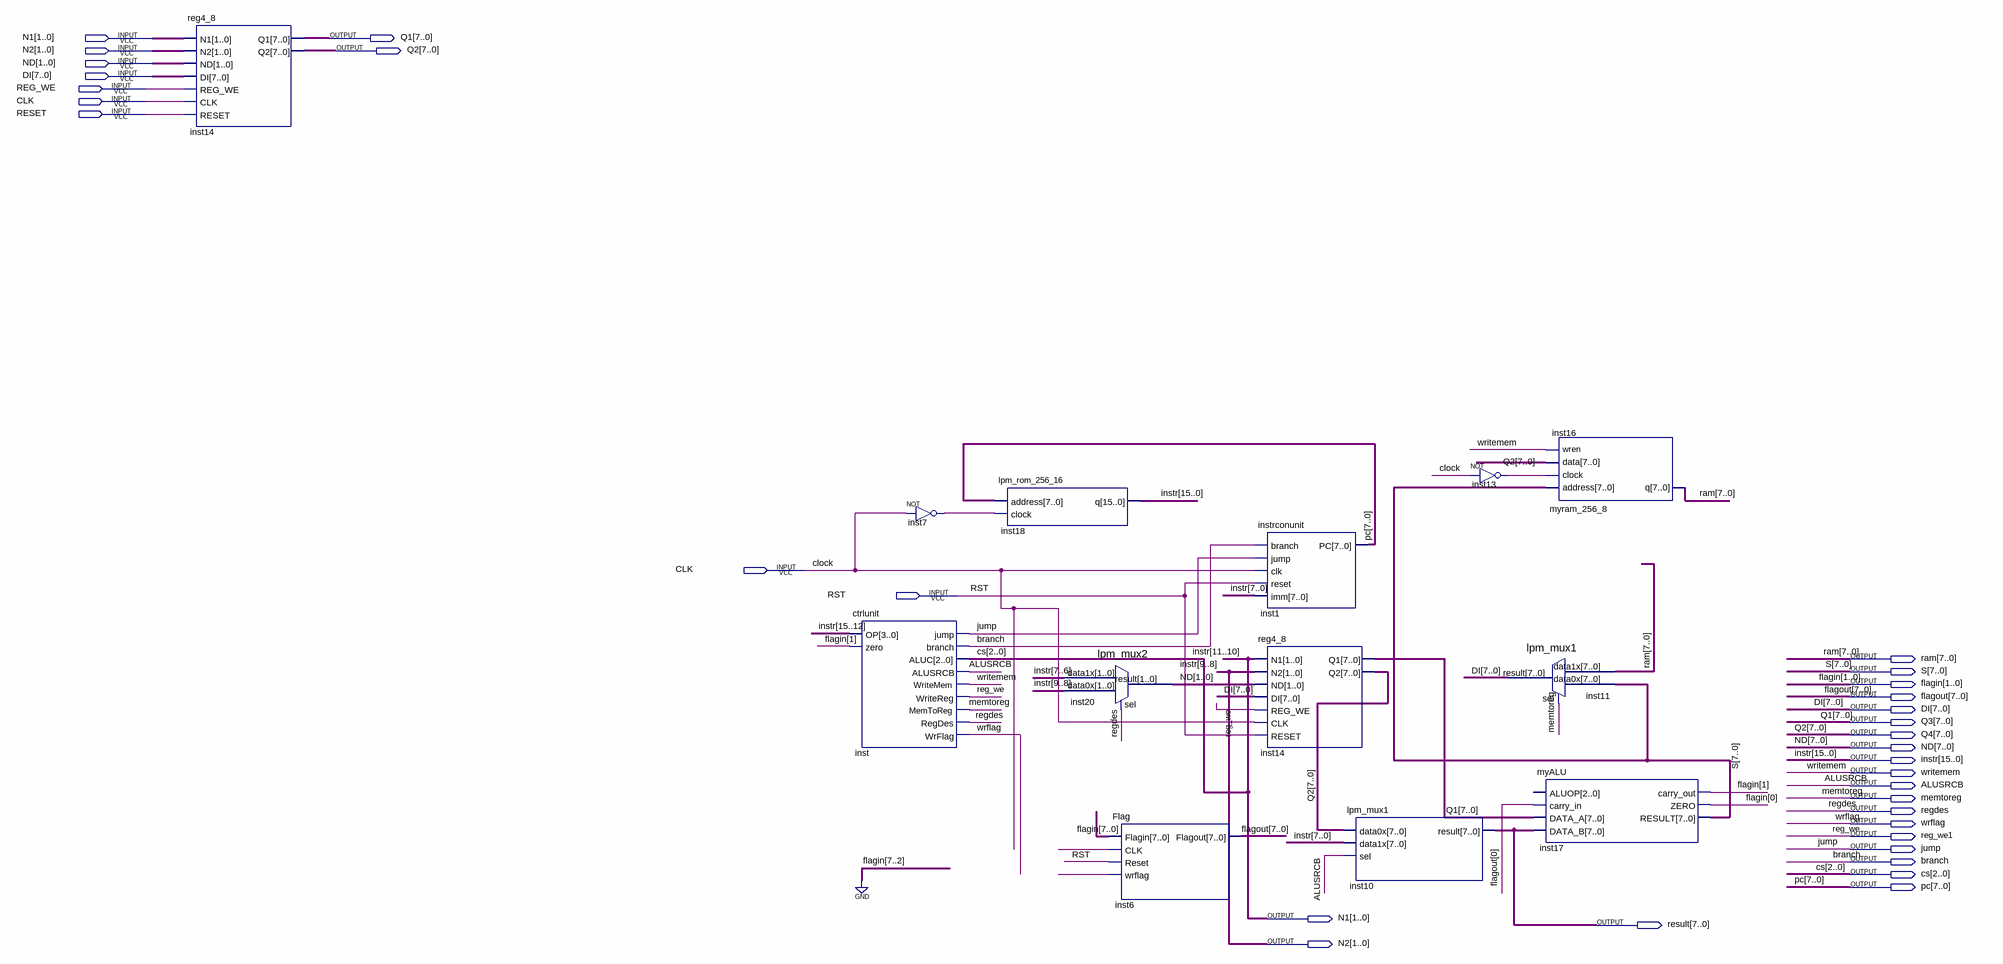
[diagram p0: schematic sheet]
// Quartus schematic test.bdf as structural Verilog: 13 symbols, 33 pins
module test (
  inout  [1:0] N1,
  inout  [1:0] N2,
  inout  [7:0] ND,
  inout  [7:0] DI,
  input  REG_WE,
  input  CLK,
  input  RESET,
  input  RST,
  output [7:0] Q1,
  output [7:0] Q2,
  output [7:0] ram,
  output [7:0] S,
  output [1:0] flagin,
  output [7:0] flagout,
  output [7:0] Q3,
  output [7:0] Q4,
  output [15:0] instr,
  output writemem,
  output ALUSRCB,
  output memtoreg,
  output regdes,
  output wrflag,
  output reg_we1,
  output jump,
  output branch,
  output [2:0] cs,
  output [7:0] pc,
  output [7:0] result
);

  wire inst7_out, inst13_out, undriven, undriven_2;

  reg4_8 inst14 (.N2(N2), .ND(ND[1:0]), .REG_WE(REG_WE), .DI(DI), .CLK(CLK), .RESET(RESET), .N1(N1), .Q2(Q2), .Q1(Q1));
  ctrlunit inst (
    .OP(instr[15:12]), .zero(flagin[1]), .jump(jump), .branch(branch), .ALUC(cs), .ALUSRCB(ALUSRCB),
    .WriteMem(writemem), .WriteReg(REG_WE), .MemToReg(memtoreg), .RegDes(regdes), .WrFlag(wrflag));
  not inst7 (inst7_out, CLK);
  lpm_rom_256_16 inst18 (.address(pc), .clock(inst7_out), .q({instr[15:10], N2, instr[7:0]}));
  lpm_mux2 inst20 (.data1x(instr[7:6]), .data0x(N2), .sel(regdes), .result(ND[1:0]));
  Flag inst6 (.Flagin({{6{1'b0}}, flagin}), .CLK(undriven), .Reset(RST), .wrflag(undriven_2), .Flagout(flagout));
  instrconunit inst1 (.branch(branch), .jump(jump), .clk(CLK), .reset(RST), .imm(instr[7:0]), .PC(pc));
  reg4_8 inst14_dup2 (
    .N2(N2), .ND(ND[1:0]), .REG_WE(REG_WE), .DI(DI), .CLK(CLK), .RESET(RST), .N1(cs), .Q2(Q2), .Q1(Q1));
  lpm_mux1 inst10 (.data0x(Q2), .data1x(instr[7:0]), .sel(ALUSRCB), .result(result));
  not inst13 (inst13_out, CLK);
  lpm_mux1 inst11 (.data1x(ram), .data0x(S), .sel(memtoreg), .result(DI));
  myram_256_8 inst16 (.address(S), .clock(inst13_out), .data(Q2), .wren(writemem), .q(ram));
  myALU inst17 (
    .carry_in(flagout[0]), .DATA_A(Q1), .DATA_B(result), .carry_out(flagin[1]), .ZERO(flagin[0]), .RESULT(S));  // open: ALUOP

  assign instr[9:8] = N2;
  assign Q3 = Q1;
  assign Q4 = Q2;
  assign reg_we1 = REG_WE;

  // Other names for the same wires on the sheet: clock = CLK
endmodule
